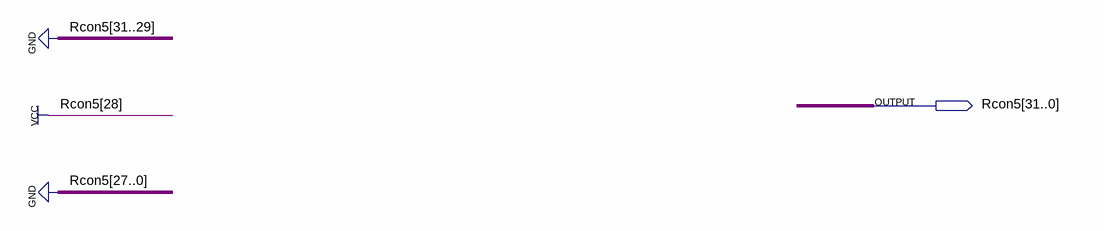
[diagram p0: schematic sheet]
// Quartus schematic Rcon5.bdf as structural Verilog: 0 symbols, 1 pins
module Rcon5 (
  output [31:0] Rcon5
);


  assign Rcon5 = 32'b00010000000000000000000000000000;
endmodule
